# EAGLE design scoreboard_v1 (EAGLE 9.1.1)
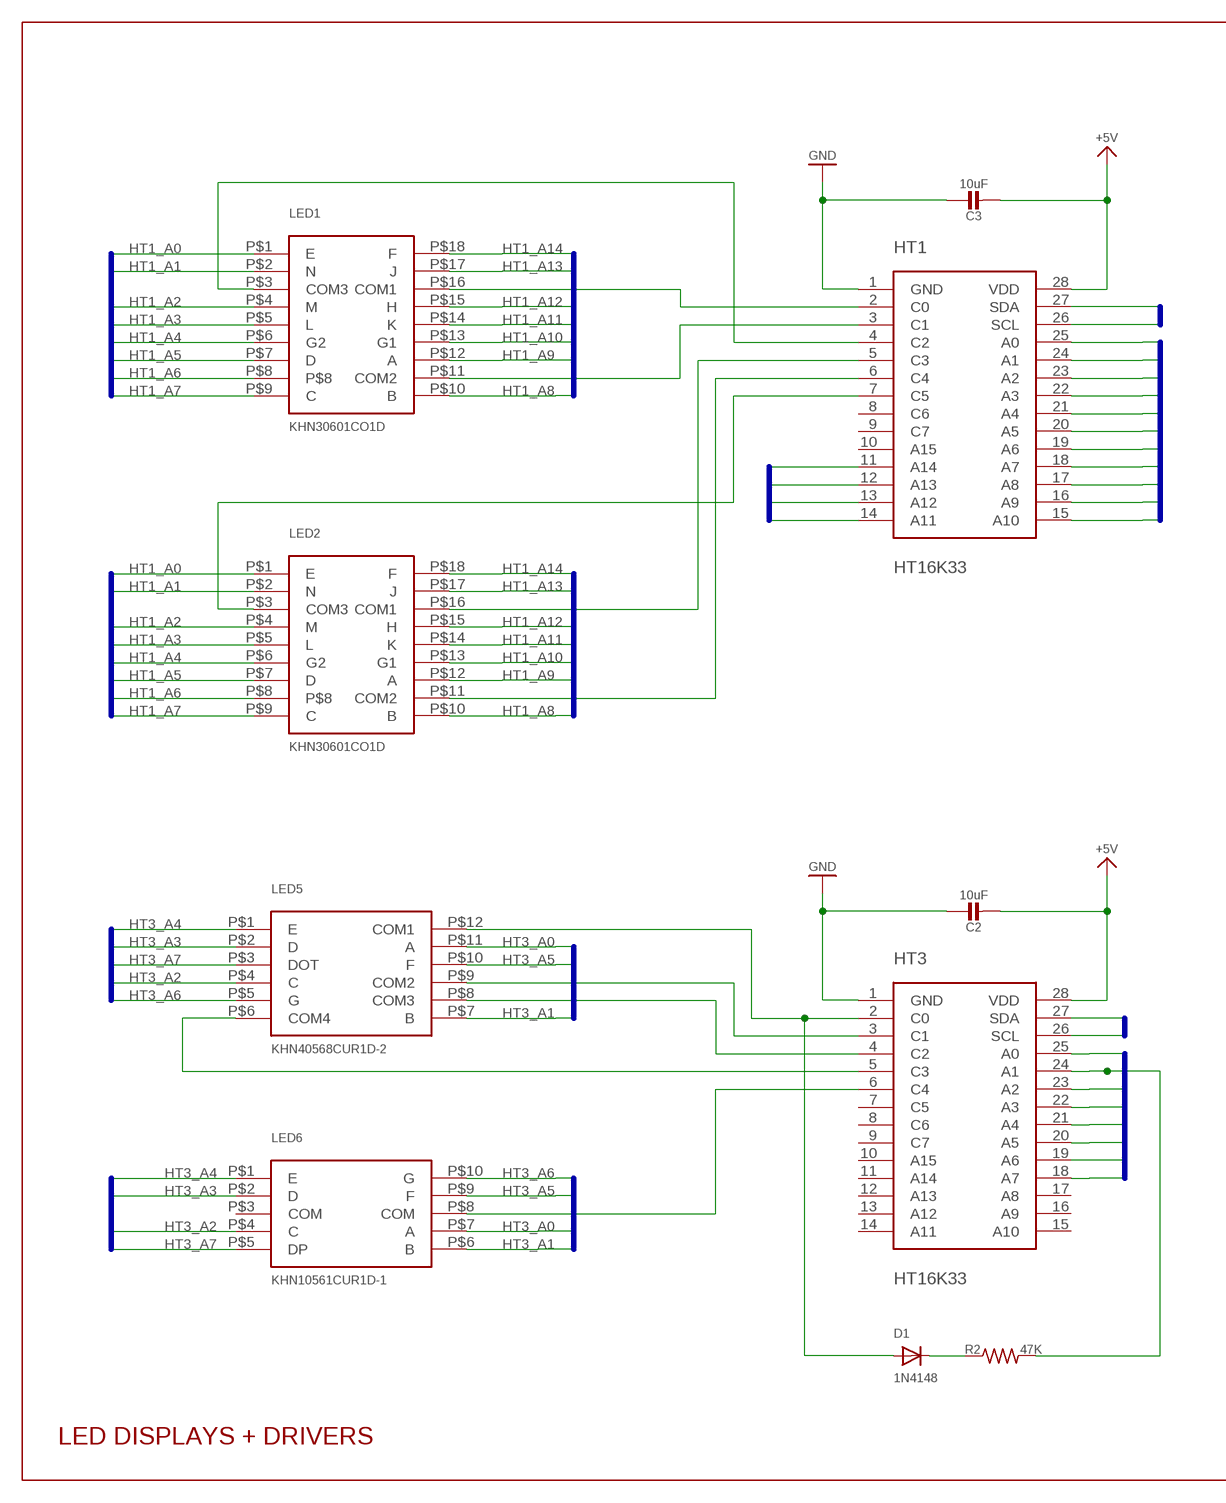
[diagram p0: schematic, sheet 1, part 1 of 2]
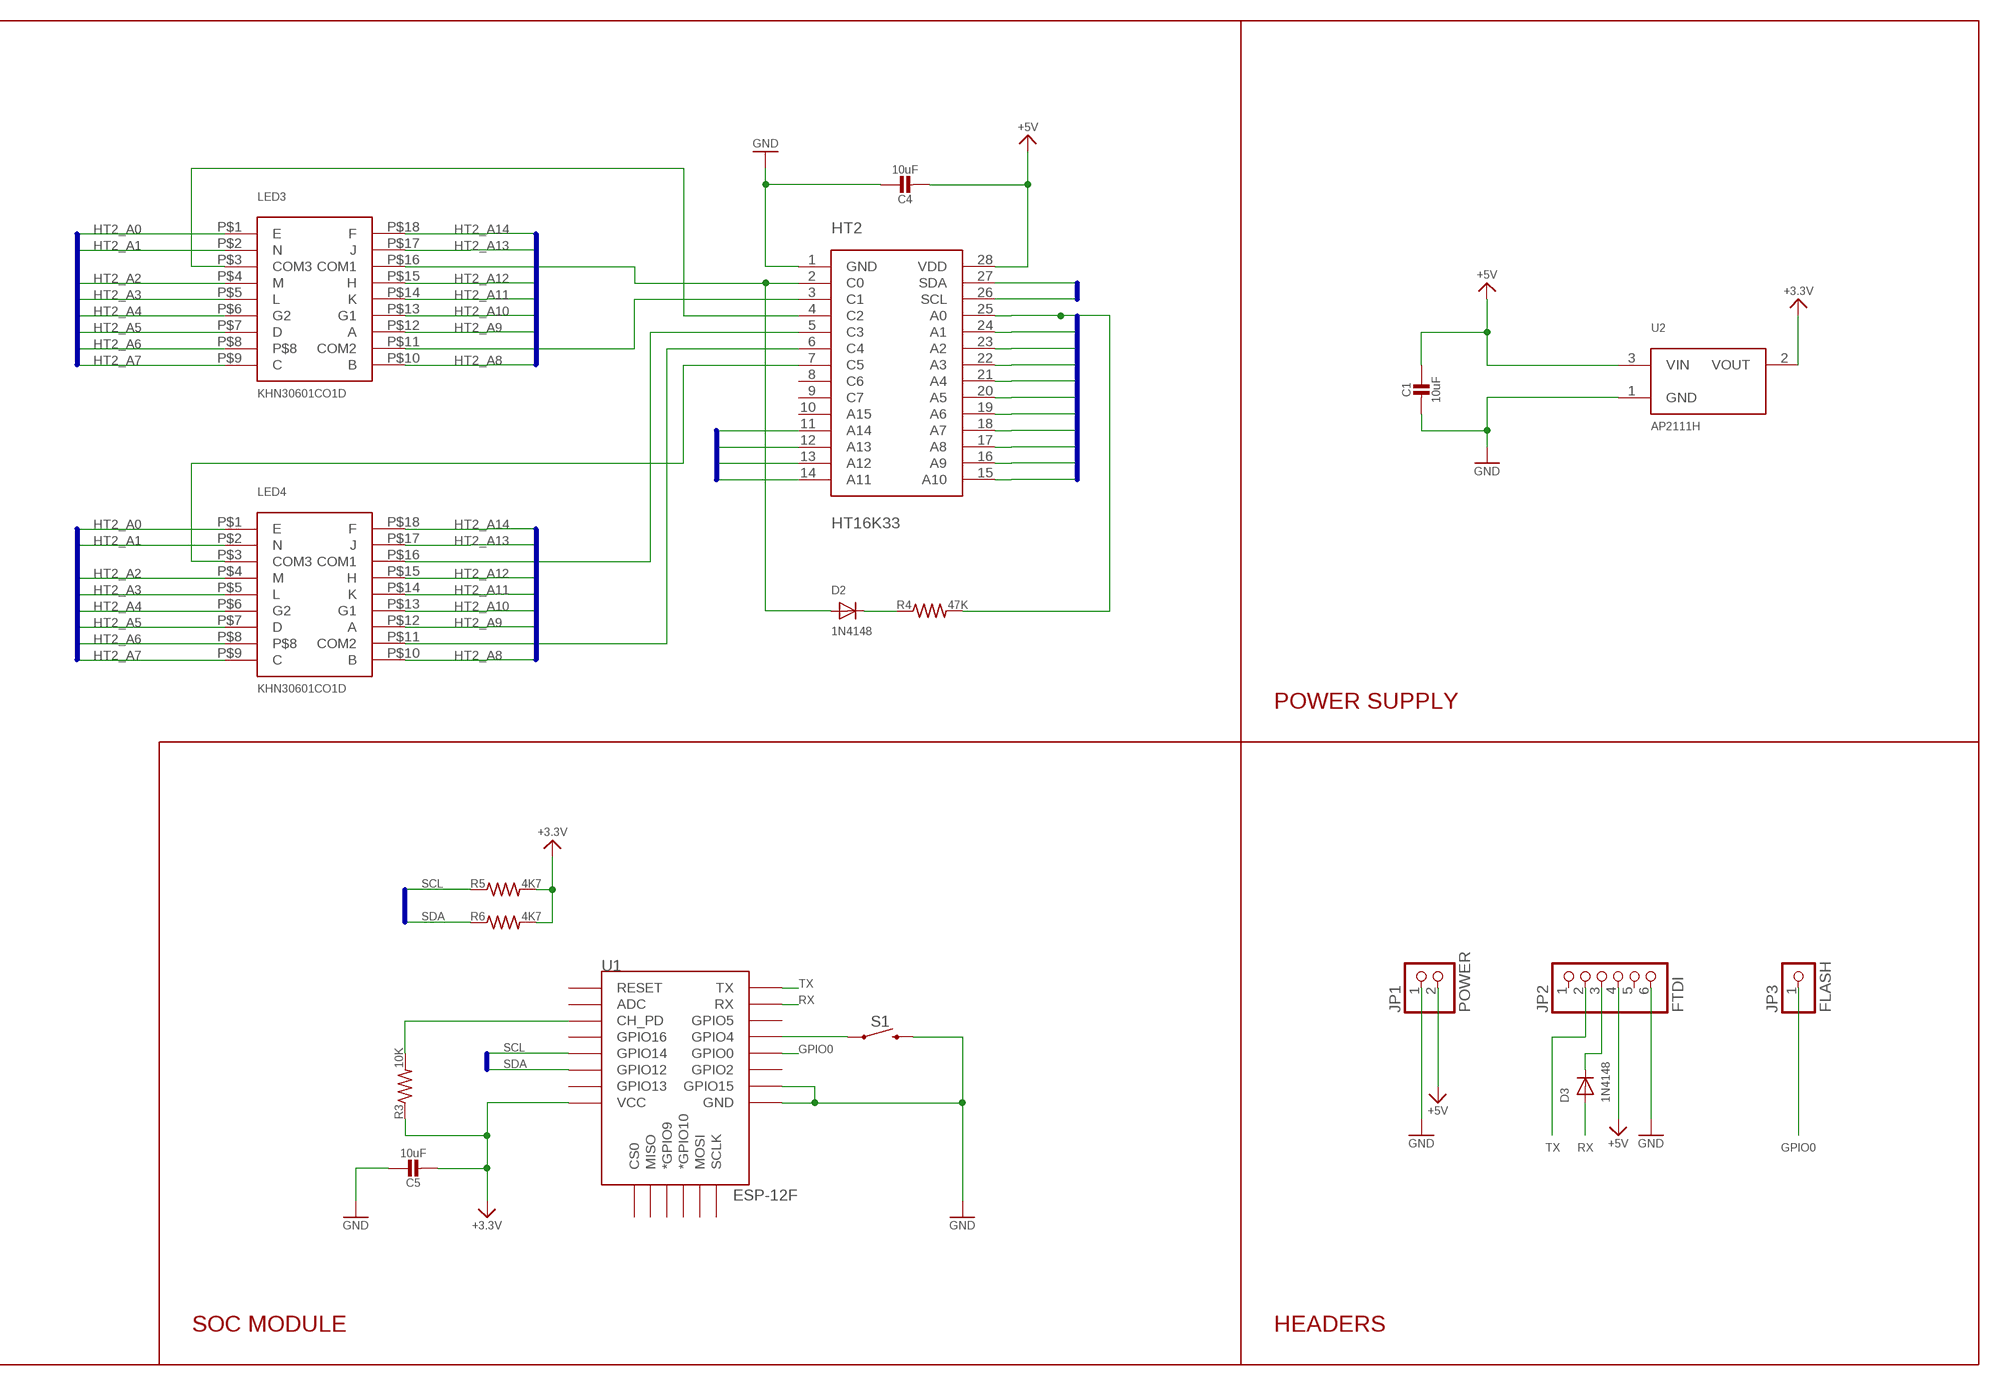
[diagram p1: schematic, sheet 1, part 2 of 2]

## Parts
C1  10uF  CAP_CERAMIC_1206  [_1206]
C2  10uF  CAP_CERAMIC_1206  [_1206]
C3  10uF  CAP_CERAMIC_1206  [_1206]
C4  10uF  CAP_CERAMIC_1206  [_1206]
C5  10uF  CAP_CERAMIC_1206  [_1206]
D1  1N4148  DIODESOD-123  [SOD-123]
D2  1N4148  DIODESOD-123  [SOD-123]
D3  1N4148  DIODESOD-123  [SOD-123]
HT1  HT16K33  [SOP28]
HT2  HT16K33  [SOP28]
HT3  HT16K33  [SOP28]
JP1  POWER  PINHD-1X2  [1X02]
JP2  FTDI  PINHD-1X6  [1X06]
JP3  FLASH  PINHD-1X1  [1X01]
LED1  KHN30601CO1D  [KHN30601CO1D]
LED2  KHN30601CO1D  [KHN30601CO1D]
LED3  KHN30601CO1D  [KHN30601CO1D]
LED4  KHN30601CO1D  [KHN30601CO1D]
LED5  KHN40568CUR1D-2  [KHN40568CUR1D-2]
LED6  KHN10561CUR1D-1  [KHN10561CUR1D-1]
R2  47K  R-US_R1206  [R1206]
R3  10K  R-US_R1206  [R1206]
R4  47K  R-US_R1206  [R1206]
R5  4K7  R-US_R1206  [R1206]
R6  4K7  R-US_R1206  [R1206]
S1  MOMENTARY-SWITCH-SPST-PTH-6.0MM  [TACTILE_SWITCH_PTH_6.0MM]
U1  ESP-12F  ESP12E  [ESP12E-SMD]
U2  AP2111H  [SOT223]

## Nets
3.3V [thick]: C5.2 R3.1 R5.2 R6.2 U1.VCC U2.2(VOUT) ; supply symbol labelled +3.3V
+5V [thick]: C1.1 C2.2 C3.2 C4.2 HT1.28(VDD) HT2.28(VDD) HT3.28(VDD) JP1.2 JP2.4 U2.3(VIN)
GND [thick]: C1.2 C2.1 C3.1 C4.1 C5.1 HT1.1(GND) HT2.1(GND) HT3.1(GND) JP1.1 JP2.6 S1.3 U1.GND U1.GPIO15 U2.1(GND)
GPIO0: JP3.1 U1.GPIO0
HT1_A0: HT1.25(A0) LED1.P$1(E) LED2.P$1(E)
HT1_A1: HT1.24(A1) LED1.P$2(N) LED2.P$2(N)
HT1_A2: HT1.23(A2) LED1.P$4(M) LED2.P$4(M)
HT1_A3: HT1.22(A3) LED1.P$5(L) LED2.P$5(L)
HT1_A4: HT1.21(A4) LED1.P$6(G2) LED2.P$6(G2)
HT1_A5: HT1.20(A5) LED1.P$7(D) LED2.P$7(D)
HT1_A6: HT1.19(A6) LED1.P$8 LED2.P$8
HT1_A7: HT1.18(A7) LED1.P$9(C) LED2.P$9(C)
HT1_A8: HT1.17(A8) LED1.P$10(B) LED2.P$10(B)
HT1_A9: HT1.16(A9) LED1.P$12(A) LED2.P$12(A)
HT1_A10: HT1.15(A10) LED1.P$13(G1) LED2.P$13(G1)
HT1_A11: HT1.14(A11) LED1.P$14(K) LED2.P$14(K)
HT1_A12: HT1.13(A12) LED1.P$15(H) LED2.P$15(H)
HT1_A13: HT1.12(A13) LED1.P$17(J) LED2.P$17(J)
HT1_A14: HT1.11(A14) LED1.P$18(F) LED2.P$18(F)
HT1_C0: HT1.2(C0) LED1.P$16(COM1)
HT1_C1: HT1.3(C1) LED1.P$11(COM2)
HT1_C2: HT1.4(C2) LED1.P$3(COM3)
HT1_C3: HT1.5(C3) LED2.P$16(COM1)
HT1_C4: HT1.6(C4) LED2.P$11(COM2)
HT1_C5: HT1.7(C5) LED2.P$3(COM3)
HT2_A0: HT2.25(A0) LED3.P$1(E) LED4.P$1(E) R4.2
HT2_A1: HT2.24(A1) LED3.P$2(N) LED4.P$2(N)
HT2_A2: HT2.23(A2) LED3.P$4(M) LED4.P$4(M)
HT2_A3: HT2.22(A3) LED3.P$5(L) LED4.P$5(L)
HT2_A4: HT2.21(A4) LED3.P$6(G2) LED4.P$6(G2)
HT2_A5: HT2.20(A5) LED3.P$7(D) LED4.P$7(D)
HT2_A6: HT2.19(A6) LED3.P$8 LED4.P$8
HT2_A7: HT2.18(A7) LED3.P$9(C) LED4.P$9(C)
HT2_A8: HT2.17(A8) LED3.P$10(B) LED4.P$10(B)
HT2_A9: HT2.16(A9) LED3.P$12(A) LED4.P$12(A)
HT2_A10: HT2.15(A10) LED3.P$13(G1) LED4.P$13(G1)
HT2_A11: HT2.14(A11) LED3.P$14(K) LED4.P$14(K)
HT2_A12: HT2.13(A12) LED3.P$15(H) LED4.P$15(H)
HT2_A13: HT2.12(A13) LED3.P$17(J) LED4.P$17(J)
HT2_A14: HT2.11(A14) LED3.P$18(F) LED4.P$18(F)
HT2_C0: D2.A HT2.2(C0) LED3.P$16(COM1)
HT2_C1: HT2.3(C1) LED3.P$11(COM2)
HT2_C2: HT2.4(C2) LED3.P$3(COM3)
HT2_C3: HT2.5(C3) LED4.P$16(COM1)
HT2_C4: HT2.6(C4) LED4.P$11(COM2)
HT2_C5: HT2.7(C5) LED4.P$3(COM3)
HT3_A0: HT3.25(A0) LED5.P$11(A) LED6.P$7(A)
HT3_A1: HT3.24(A1) LED5.P$7(B) LED6.P$6(B) R2.2
HT3_A2: HT3.23(A2) LED5.P$4(C) LED6.P$4(C)
HT3_A3: HT3.22(A3) LED5.P$2(D) LED6.P$2(D)
HT3_A4: HT3.21(A4) LED5.P$1(E) LED6.P$1(E)
HT3_A5: HT3.20(A5) LED5.P$10(F) LED6.P$9(F)
HT3_A6: HT3.19(A6) LED5.P$5(G) LED6.P$10(G)
HT3_A7: HT3.18(A7) LED5.P$3(DOT) LED6.P$5(DP)
HT3_C0: D1.A HT3.2(C0) LED5.P$12(COM1)
HT3_C1: HT3.3(C1) LED5.P$9(COM2)
HT3_C2: HT3.4(C2) LED5.P$8(COM3)
HT3_C3: HT3.5(C3) LED5.P$6(COM4)
HT3_C4: HT3.6(C4) LED6.P$8(COM)
N$1: S1.1 U1.GPIO4
N$2: D3.C JP2.3
N$5: D1.C R2.1
N$6: R3.2 U1.CH_PD
N$8: D2.C R4.1
RX: D3.A U1.RXD0(RX)
SCL: HT1.26(SCL) HT2.26(SCL) HT3.26(SCL) R5.1 U1.GPIO14
SDA: HT1.27(SDA) HT2.27(SDA) HT3.27(SDA) R6.1 U1.GPIO12
TX: JP2.2 U1.TXD0(TX)
Unconnected: HT1.8(C6) HT1.9(C7) HT1.10(A15) HT2.8(C6) HT2.9(C7) HT2.10(A15) HT3.7(C5) HT3.8(C6) HT3.9(C7) HT3.10(A15) HT3.11(A14) HT3.12(A13) HT3.13(A12) HT3.14(A11) HT3.15(A10) HT3.16(A9) HT3.17(A8) JP2.1 JP2.5 LED6.P$3(COM) U1.ADC U1.CS0 U1.GPIO2 U1.GPIO5 U1.GPIO9(*GPIO9) U1.GPIO10(*GPIO10) U1.GPIO13 U1.GPIO16 U1.MISO U1.MOSI U1.RESET U1.SCLK

## Buses
HT1A:HT1_A[0..7]
HT1B:HT1_A[8..14]
HT1_A[11..14]
HT1_A[0..10]
HT2B:HT2_A[8..14]
HT2_A[11..14]
HT2A:HT2_A[0..7]
HT2_A[0..10]
HT3:HT3_A[0..7]
I2C:SCL,SDA

## Notes on the sheet
- POWER SUPPLY
- LED DISPLAYS + DRIVERS | SOC MODULE | HEADERS

## Library data of the parts
C1-C5 = scoreboard_v1:CAP_CERAMIC: Ceramic Capacitors For new designs, use the packages preceded by an '_' character since they are more reliable: The following footprints should be used on most boards: _0402 - Standard footprint for regular board layouts _0603 - Standard footprint for regular board layouts _0805 - Standard footprint for regular board layouts _1206 - Standard footprint for regular board layouts For extremely tight-pitch boards where space is at a premium, the following 'micro-pitch' footprints can be used (smaller pads, no silkscreen outline, etc.): _0402MP - Micro-pitch footprint for very dense/compact boards _0603MP - Micro-pitch footprint for very dense/compact boards _0805MP - Micro-pitch footprint for very dense/compact boards _1206MP - Micro-pitch footprint for very dense/compact boards
D1-D3 = scoreboard_v1:DIODE: Diode SMADIODE - SMA Surface Mount Package 20V 1A Schottky Diode Digikey: 641-1014-6-ND DO-1N4148 - Through Hole Small Current Diode SOD-123 20V 1 A (.5mV Vf) Schottky Diode - Digikey: MBRX120TPMSCT-ND SOD-323 10V 570mA (.38mV Vf, 3ns) Schottky Diode - Digikey: ZLLS410CT-ND SOD-523 30V 30mA Schottky Diode (RB751S-40TE61) - Digikey: RB751S-40TE61CT-ND SOT23-R/W - SOT23 Package (R = Solder Paste/Reflow Ovens, W = Hand-Soldering) BAT54Film 40V 300mA - Digikey: 497-7162-1-ND
HT1-HT3 = scoreboard_v1:HT16K33: I2C LED Matrix Driver
JP1 = pinhead:PINHD-1X2: PIN HEADER
JP2 = pinhead:PINHD-1X6: PIN HEADER
JP3 = pinhead:PINHD-1X1: PIN HEADER
LED1-LED4 = ScoreBoard:KHN30601CO1D: 37.9*21.1*7.8mm, Amber color, 3-digit 14-segment LED Display
LED5 = ScoreBoard:KHN40568CUR1D-2: 4-digit 0.56inch, Red, Common cathode, LED Display
LED6 = ScoreBoard:KHN10561CUR1D-1: 1-digit 0.56inch, Red, Common cathode, LED Display
R2-R6 = scoreboard_v1:R-US_: RESISTOR, American symbol
S1 = scoreboard_v1:MOMENTARY-SWITCH-SPST: Momentary Switch (Pushbutton) - SPST Normally-open (NO) SPST momentary switches (buttons, pushbuttons). Variants PTH-12MM - 12mm square, through-hole Momentary Pushbutton Switch - 12mm Square <https://www.sparkfun.com/products/9190> (COM-09190) PTH-6.0MM, PTH-6.0MM-KIT - 6.0mm square, through-hole Mini Pushbutton Switch <https://www.sparkfun.com/products/97> (COM-00097) KIT package intended for soldering kit's - only one side of pads' copper is exposed. PTH-RIGHT-ANGLE-KIT - Right-angle, through-hole Right Angle Tactile Button <https://www.sparkfun.com/products/10791> - Used on SparkFun BigTime Watch Kit <https://www.sparkfun.com/products/11734> SMD-12MM - 12mm square, surface-mount Tactile Button - SMD (12mm) <https://www.sparkfun.com/products/12993> (COM-12993) Used on SparkFun PicoBoard <https://www.sparkfun.com/products/11888> SMD-4.5MM - 4.5mm Square Trackball Switch Used on SparkFun Blackberry Trackballer Breakout <https://www.sparkfun.com/products/13169> SMD-4.6MMX2.8MM - 4.60mm x 2.80mm, surface mount Used on SparkFun SAMD21 Mini Breakout <https://www.sparkfun.com/products/13664> SMD-5.2MM, SMD-5.2-REDUNDANT - 5.2mm square, surface-mount Mini Pushbutton Switch - SMD <https://www.sparkfun.com/products/8720> (COM-08720) Used on Arduino Pro Mini <https://www.sparkfun.com/products/11114> REDUNDANT package connects both switch circuits together SMD-6.0X3.5MM - 6.0 x 3.5mm, surface mount Momentary Reset Switch SMD <https://www.sparkfun.com/products/8229> (COM-08229) SMD-6.2MM-TALL - 6.2mm square, surface mount Tactile Button - SMD (6mm) <https://www.sparkfun.com/products/12992> Used on SparkFun Digital Sandbox <https://www.sparkfun.com/products/12651> SMD-RIGHT-ANGLE - Right-angle, surface mount Used on SparkFun Block for Intel® Edison - Arduino <https://www.sparkfun.com/products/13036>; PROD_ID: SWCH-08441; SF_SKU: COM-00097; SPICEPREFIX: B
U1 = scoreboard_v1:ESP12E: ESP12E Module
U2 = scoreboard_v1:AP2111H

## Net classes
1 thick: width 0.381 mm, drill 0.254 mm, clearance 0.254 mm to class 0, clearance 0.254 mm

## Board
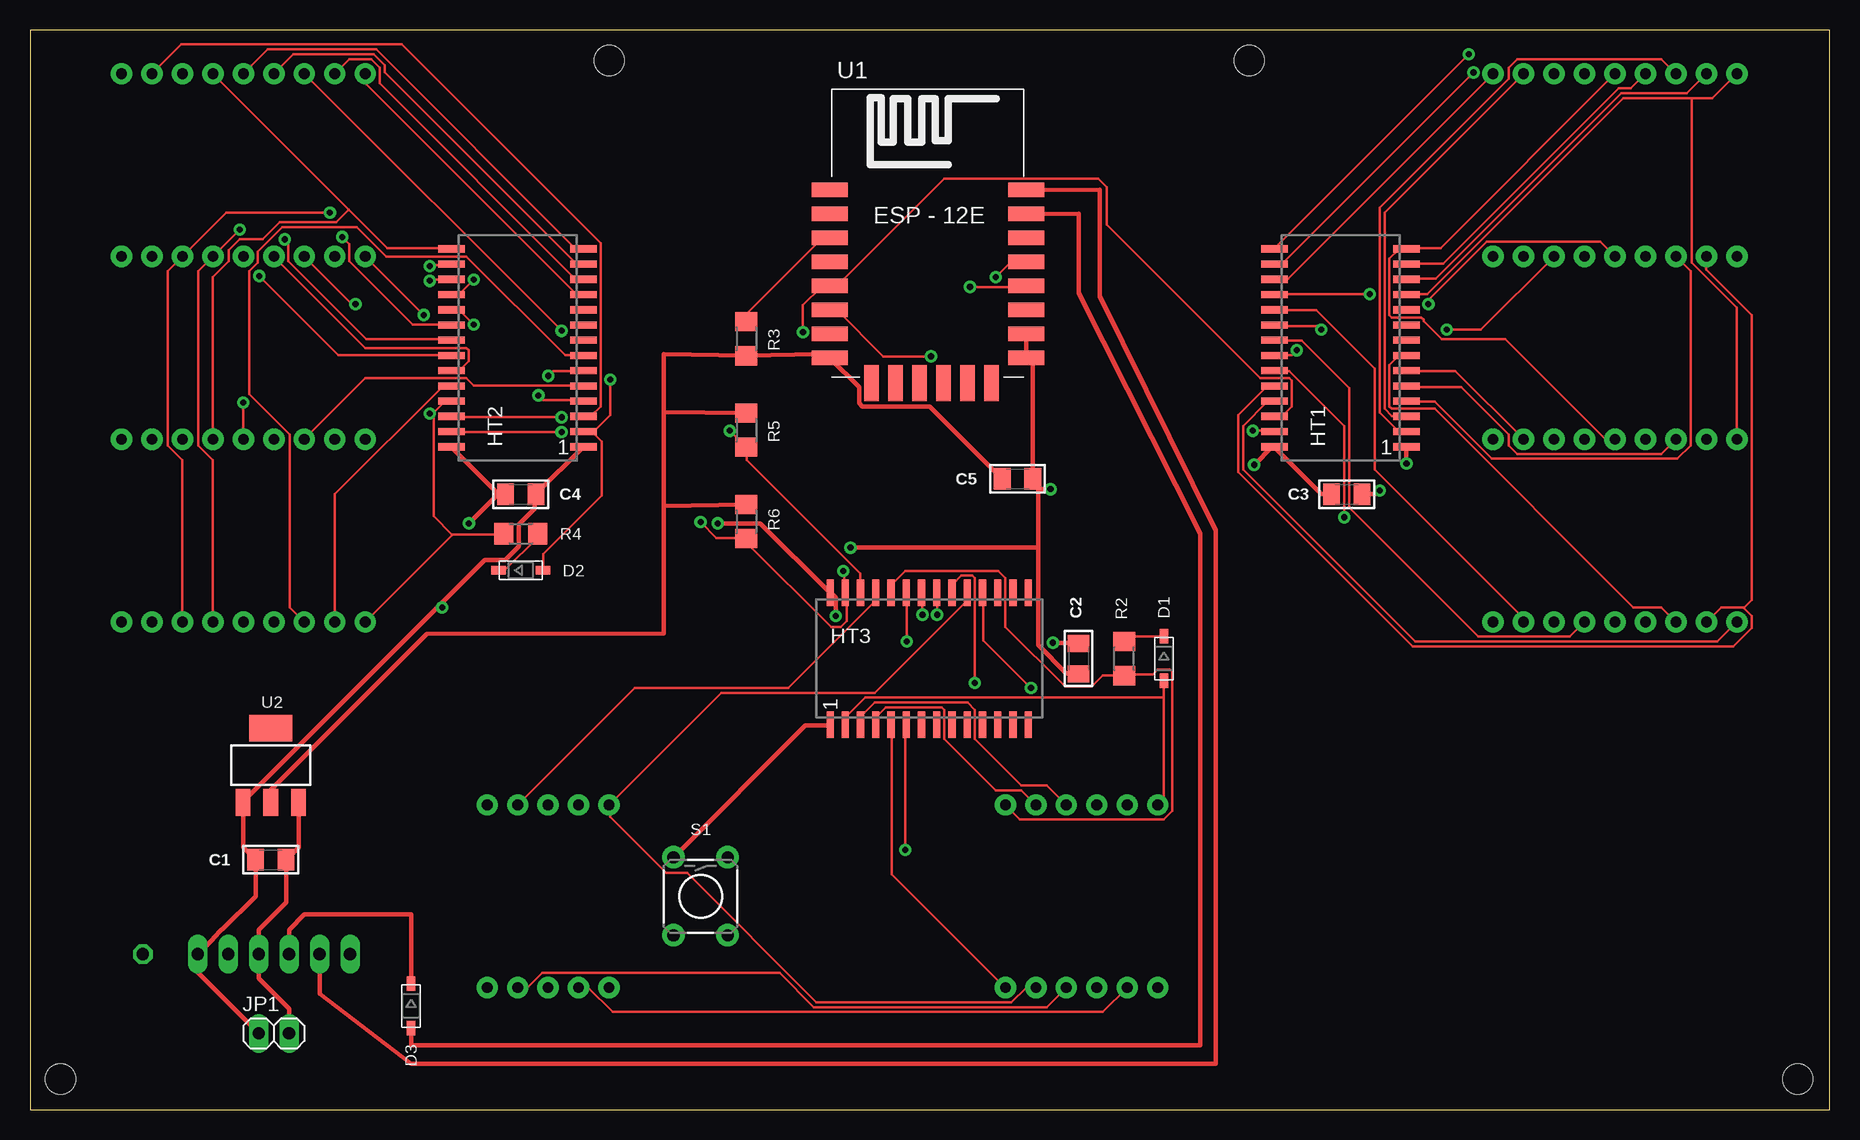
[diagram p2: board, top side]
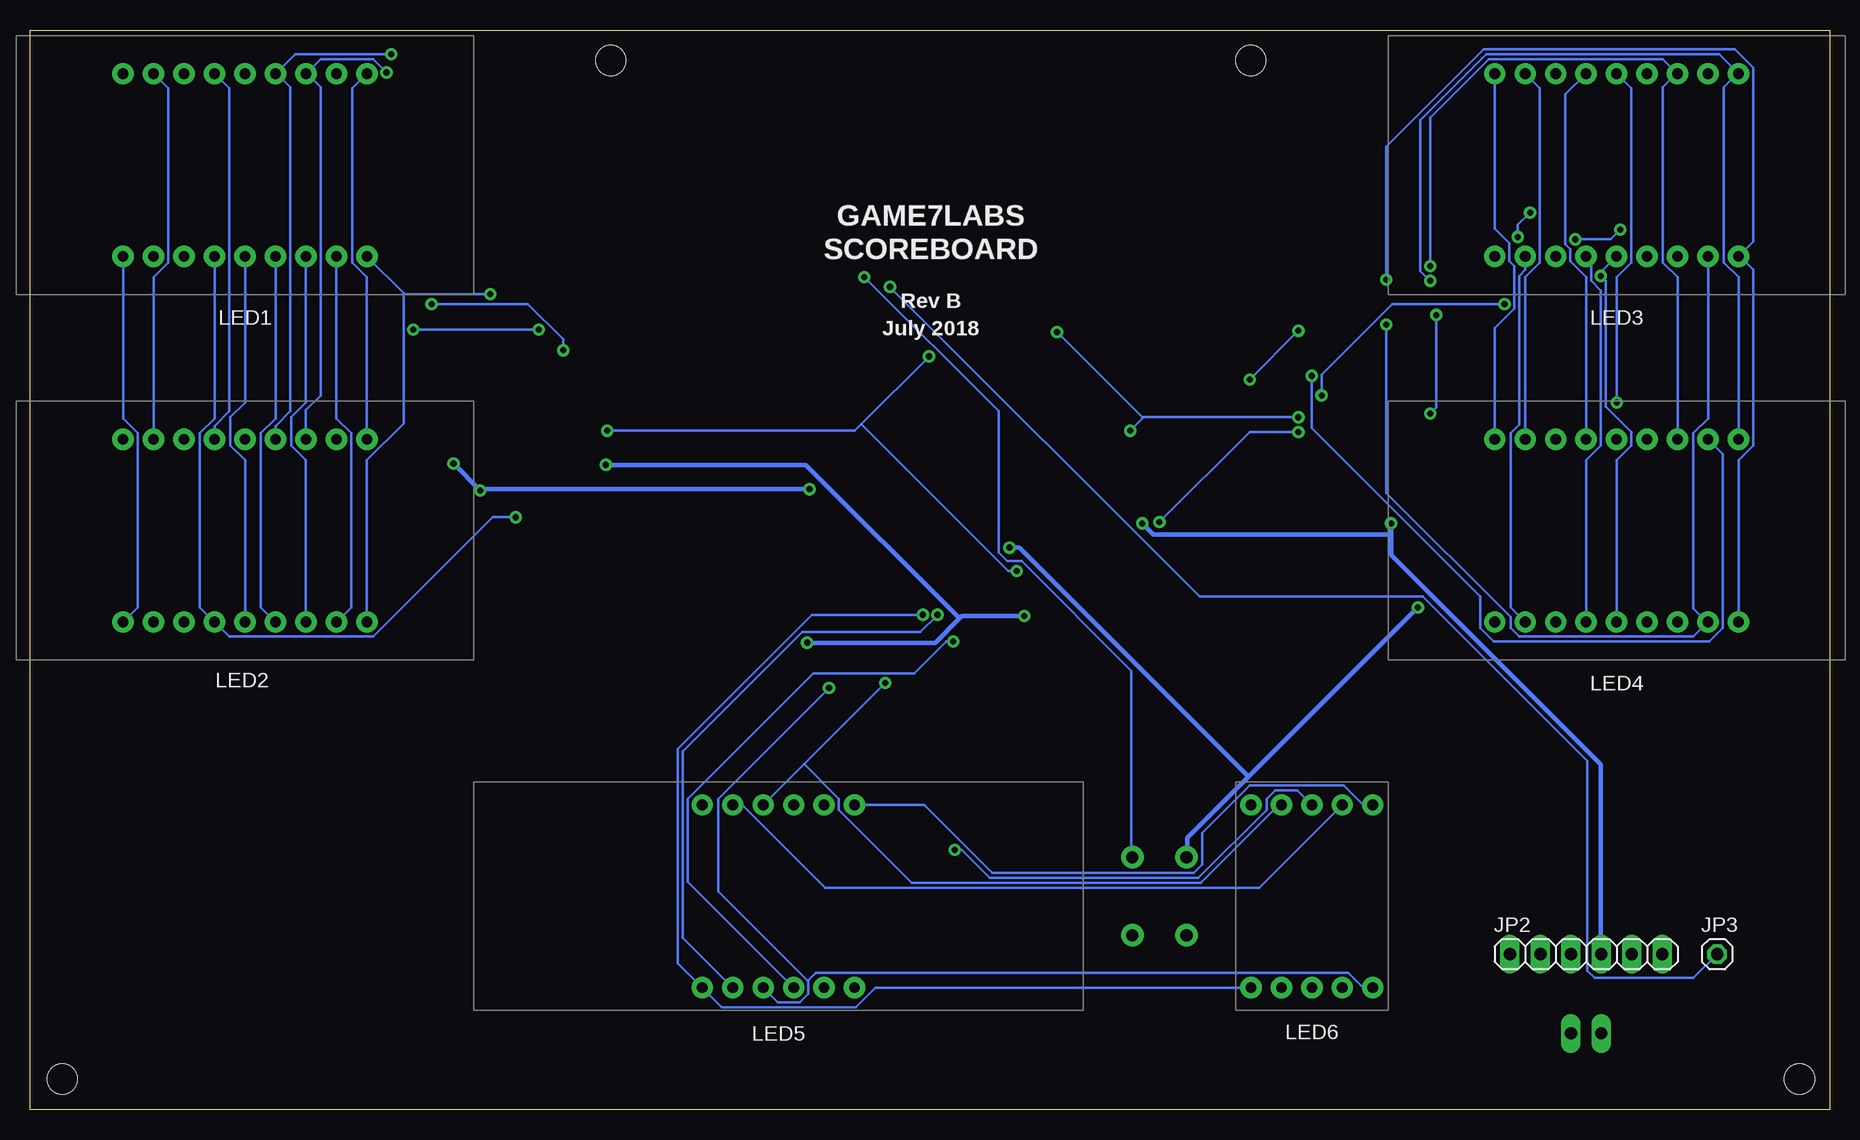
[diagram p3: board, bottom side, seen from below]

Size 150 x 90 mm. Coordinates in mm from the lower left corner, seen from the top.
Outline: 0,0 150,0 150,90 0,90 0,0
Copper layers (1*16): Top 0.035mm / dielectric 1.5mm / Bottom 0.035mm
Design rules "SparkFun": minimum track width 8mil, minimum drill 20mil, track to track 8mil, track to pad 8mil, pad to pad 8mil, via to via 8mil, smd to smd 8mil, copper to edge 10mil, drill to drill 8mil, minimum pad ring 12mil, minimum via ring 10mil, stop-mask expansion 4mil, vias tented up to drill 25mil, thermal gap 10mil
Holes 2.5 mm at 2.54,2.54 147.32,2.54 48.26,87.46 101.6,87.46

### Footprints (pad centres in the part's own frame; a part is rotated, then mirrored left to right if it is on the bottom)
_1206 = smd 1.4 x 1.8: 1 -1.27,0; 2 1.27,0
SOD-123 = smd 1.2 x 0.7: A 1.85,0; C -1.85,0
SOP28 = smd 0.6 x 2.2: 1 -8.255,-5.5; 2 -6.985,-5.5; 3 -5.715,-5.5; 4 -4.445,-5.5; 5 -3.175,-5.5; 6 -1.905,-5.5; 7 -0.635,-5.5; 8 0.635,-5.5; 9 1.905,-5.5; 10 3.175,-5.5; 11 4.445,-5.5; 12 5.715,-5.5; 13 6.985,-5.5; 14 8.255,-5.5; 15 8.255,5.5; 16 6.985,5.5; 17 5.715,5.5; 18 4.445,5.5; 19 3.175,5.5; 20 1.905,5.5; 21 0.635,5.5; 22 -0.635,5.5; 23 -1.905,5.5; 24 -3.175,5.5; 25 -4.445,5.5; 26 -5.715,5.5; 27 -6.985,5.5; 28 -8.255,5.5
1X02 = drill 1.016 long: 1 -1.27,0; 2 1.27,0
1X06 = drill 1.016 long: 1 -6.35,0; 2 -3.81,0; 3 -1.27,0; 4 1.27,0; 5 3.81,0; 6 6.35,0
1X01 = drill 1.016 octagon: 1 0,0
KHN30601CO1D = drill 0.889 pad 1.778: P$1 0,0; P$2 2.54,0; P$3 5.08,0; P$4 7.62,0; P$5 10.16,0; P$6 12.7,0; P$7 15.24,0; P$8 17.78,0; P$9 20.32,0; P$10 20.32,15.24; P$11 17.78,15.24; P$12 15.24,15.24; P$13 12.7,15.24; P$14 10.16,15.24; P$15 7.62,15.24; P$16 5.08,15.24; P$17 2.54,15.24; P$18 0,15.24
KHN40568CUR1D-2 = drill 0.889 pad 1.778: P$1 0,0; P$2 2.54,0; P$3 5.08,0; P$4 7.62,0; P$5 10.16,0; P$6 12.7,0; P$7 12.7,15.24; P$8 10.16,15.24; P$9 7.62,15.24; P$10 5.08,15.24; P$11 2.54,15.24; P$12 0,15.24
KHN10561CUR1D-1 = drill 0.889 pad 1.778: P$1 0,0; P$2 2.54,0; P$3 5.08,0; P$4 7.62,0; P$5 10.16,0; P$6 10.16,15.24; P$7 7.62,15.24; P$8 5.08,15.24; P$9 2.54,15.24; P$10 0,15.24
R1206 = smd 1.6 x 1.803: 1 -1.422,0; 2 1.422,0
TACTILE_SWITCH_PTH_6.0MM = drill 1.016 pad 1.88: 1 -3.251,2.261; 2 3.251,2.261; 3 -3.251,-2.261; 4 3.251,-2.261
ESP12E-SMD = smd 3 x 1.2: ADC -8.3,3.8; CH_PD -8.3,1.8; GND 8.1,-8.2; GPIO0 8.1,-2.2; GPIO2 8.1,-4.2; GPIO4 8.1,-0.2; GPIO5 8.1,1.8; GPIO12 -8.3,-4.2; GPIO13 -8.3,-6.2; GPIO14 -8.3,-2.2; GPIO15 8.1,-6.2; GPIO16 -8.3,-0.2; RESET -8.3,5.8; RXD0 8.1,3.8; TXD0 8.1,5.8; VCC -8.3,-8.2 | smd 1.2 x 3: CS0 -4.8,-10.3; GPIO9 -0.8,-10.3; GPIO10 1.2,-10.3; MISO -2.8,-10.3; MOSI 3.2,-10.3; SCLK 5.2,-10.3
SOT223 = smd 1.219 x 2.235: 1 -2.311,-3.099; 2 0,-3.099; 3 2.311,-3.099 | smd 3.6 x 2.2: 4 0,3.099

### Placement (x,y rotation side)
C1  20.07,20.83 180 top
C2  87.38,37.59 90 top
C3  109.73,51.31 180 top
C4  40.89,51.31 180 top
C5  82.3,52.58 180 top
D1  94.49,37.59 270 top
D2  40.89,44.96 0 top
D3  31.75,8.64 270 top
HT1  109.22,63.5 90 top
HT2  40.64,63.5 90 top
HT3  74.93,37.59 0 top
JP1  20.32,6.35 0 top
JP2  20.32,12.95 0 bottom
JP3  9.4,12.95 0 bottom
LED1  142.24,71.12 0 bottom
LED2  142.24,40.64 0 bottom
LED3  27.94,71.12 0 bottom
LED4  27.94,40.64 0 bottom
LED5  93.98,10.16 0 bottom
LED6  48.26,10.16 0 bottom
R2  91.19,37.59 270 top
R3  59.69,64.26 90 top
R4  40.89,48.01 180 top
R5  59.69,56.64 90 top
R6  59.69,49.02 90 top
S1  55.88,17.78 270 top
U1  74.93,70.87 0 top
U2  20.07,28.7 0 top

### Tracks (layer width: path | path; a pad name or v marks a point on that pad's centre or on a via)
3.3V
  Top 0.381: 52.83,50.29 52.83,39.7 33.07,39.65 20.07,26.65 U2.2 | 52.83,50.29 R6.2 | 52.83,50.29 52.83,58.17 | 52.83,58.17 R5.2 | 52.83,58.17 52.83,62.99 R3.1 65.79,62.99 U1.VCC 69.08,60.21 69.08,58.88 69.35,58.62 74.98,58.62 C5.2
+5V  (via drill 0.51)
  Top 0.381: JP1.2 21.59,8.38 19.05,10.92 JP2.4 19.05,14.99 21.34,17.27 C1.1 22.38,21.87 U2.3 | C3.2 108.41,51.31 107.59,51.31 103.73,55.17 HT1.28 103.53,55.27 v102.01,53.75 | v85.24,38.91 87.38,38.91 C2.2 | v67.16,41.15 67.16,42.67 66.75,43.08 HT3.28 66.55,43.18 60.86,48.87 v57.3,48.87 | 39.01,51.31 C4.2 | 39.01,51.31 35.15,55.17 HT2.28 | v36.58,48.87 38.91,51.21 39.01,51.31
  Bottom 0.381: v85.24,38.91 74.57,38.91 72.54,40.95 | 72.54,40.95 72.34,41.15 v67.16,41.15 | v102.01,53.75 85.34,53.75 72.64,41.05 72.54,40.95 | 36.58,47.95 36.58,46.23 19.1,28.75 19.1,13.01 JP2.4 | 36.58,47.95 v36.58,48.87 | v57.3,48.87 56.39,47.95 36.68,47.95 36.58,47.95
GND  (via drill 0.51)
  Top 0.381: JP1.1 13.97,11.43 JP2.6 15.25,14.24 15.25,14.29 15.99,15.02 16.04,15.02 18.8,17.78 C1.2 17.75,21.87 U2.1 17.78,25.7 34.14,42.06 | C5.1 83.57,62.48 U1.GND 83.01,62.79 83.01,64.62 U1.GPIO15 | v112.47,51.61 112.17,51.31 111.05,51.31 C3.1 | v114.71,53.85 114.71,55.17 HT1.1 | 84.02,46.84 84.02,52.02 83.62,52.43 C5.1 | 84.02,46.84 84.02,38.71 86.36,36.37 87.38,36.37 C2.1 | v85.04,51.71 84.12,51.71 C5.1 | HT3.1 66.65,32 64.62,32 53.65,21.03 S1.3 | HT2.1 46.13,55.27 C4.1 42.06,51.21 42.06,50.09 40.74,48.77 40.74,46.94 39.62,45.82 37.9,45.82 34.14,42.06 | v34.34,41.86 34.24,41.96 34.14,42.06 | v68.38,46.84 83.92,46.84 84.02,46.84
  Bottom 0.381: v114.71,53.85 v112.47,51.61 112.37,51.71 v85.04,51.71 | v34.34,41.86 48.46,27.74 | 48.46,27.74 53.54,22.66 53.54,21.03 S1.3 | v68.38,46.84 67.56,46.84 48.56,27.84 48.46,27.74
GPIO0  (via drill 0.51)
  Top 0.203: v78.33,68.58 83.01,68.58 U1.GPIO0
  Bottom 0.203: v78.33,68.58 52.53,42.77 33.93,42.77 20.22,29.06 20.22,11.58 19.61,10.97 11.38,10.97 9.45,12.9 JP3.1
HT1_A0
  Top 0.203: LED2.P$1 140.61,39.01 115.42,39.01 101.09,53.34 101.09,57 103.12,59.03 103.63,59.03 HT1.25
  Bottom 0.203: LED1.P$1 142.24,57.61 141.02,56.39 141.02,41.86 LED2.P$1
HT1_A1
  Top 0.203: 142.8,41.81 142.75,41.86 140.92,41.86 LED2.P$2 | 142.8,41.81 143.46,41.15 143.46,40.13 141.94,38.61 115.21,38.61 100.69,53.14 100.69,57.91 103.02,60.25 103.63,60.25 HT1.24 | LED1.P$2 139.7,70 143.46,66.24 143.46,42.47 142.85,41.86 142.8,41.81
HT1_A2  (via drill 0.51)
  Top 0.203: v109.53,49.38 109.53,57 104.95,61.57 103.73,61.57 HT1.23
  Bottom 0.203: v109.53,49.38 111.45,49.38 121.41,39.42 133.4,39.42 LED2.P$4 135.84,41.86 135.84,56.39 134.62,57.61 LED1.P$4
HT1_A3  (via drill 0.51)
  Top 0.203: v105.56,63.3 105.16,62.89 103.73,62.89 HT1.22 | v116.53,67.16 116.53,67.46 121.41,72.34 130.86,72.34 LED1.P$5
  Bottom 0.203: v105.56,63.3 105.56,64.21 108.51,67.16 v116.53,67.16 | LED2.P$5 132.08,54.15 133.3,55.37 133.3,57.71 132.08,58.93 LED1.P$5
HT1_A4
  Top 0.203: LED2.P$6 128.32,39.42 120.7,39.42 109.93,50.19 109.93,60.15 105.97,64.11 103.73,64.11 HT1.21
  Bottom 0.203: LED1.P$6 129.54,57.61 130.76,56.39 130.76,41.86 LED2.P$6
HT1_A5  (via drill 0.51)
  Top 0.203: v107.59,65.02 107.29,65.33 103.73,65.33 HT1.20 | v118.06,65.02 120.9,65.02 LED1.P$7
  Bottom 0.203: v118.06,65.02 v107.59,65.02 | LED2.P$7 127,54.15 128.22,55.37 128.22,57.71 127,58.93 LED1.P$7
HT1_A6
  Top 0.203: LED2.P$8 124.46,40.95 112.06,53.34 112.06,61.77 107.19,66.65 103.73,66.65 HT1.19
  Bottom 0.203: LED1.P$8 124.46,57.61 123.24,56.39 123.24,41.86 LED2.P$8
HT1_A7  (via drill 0.51)
  Top 0.203: v111.66,67.97 103.73,67.97 HT1.18
  Bottom 0.203: v111.66,67.97 118.77,67.97 118.82,68.02 | LED1.P$9 118.82,68.02 | LED2.P$9 121.92,54.15 118.87,57.2 118.87,67.97 118.82,68.02
HT1_A8
  Top 0.203: LED1.P$10 104.85,69.29 103.73,69.29 HT1.17
  Bottom 0.203: LED2.P$10 121.92,69.39 123.14,70.61 123.14,85.14 LED1.P$10
HT1_A9  (via drill 0.51)
  Top 0.203: v120.29,86.46 104.34,70.51 103.73,70.51 HT1.16
  Bottom 0.203: v120.29,86.46 121.41,87.58 125.78,87.58 LED1.P$12 126.9,86.36 125.78,85.24 125.78,59.54 127,58.32 LED2.P$12
HT1_A10  (via drill 0.51)
  Top 0.203: v119.89,87.99 103.73,71.83 HT1.15
  Bottom 0.203: v119.89,87.99 127.91,87.99 LED1.P$13 129.44,86.36 128.32,85.24 128.32,58.22 129.54,57 LED2.P$13
HT1_A11
  Top 0.203: LED1.P$14 117.55,71.83 114.81,71.83 HT1.14 114.71,71.73 114.1,71.73 113.28,70.92 113.28,66.24 113.49,66.04 115.93,66.04 116.13,65.84 116.13,65.73 117.65,64.21 122.94,64.21 131.27,55.88 LED2.P$14
HT1_A12
  Top 0.203: LED1.P$15 133.4,85.14 132.38,85.14 117.75,70.51 114.81,70.51 HT1.13
  Bottom 0.203: LED2.P$15 134.62,57 133.4,58.22 133.4,85.14 LED1.P$15
HT1_A13
  Top 0.203: LED1.P$17 138.07,84.73 132.59,84.73 117.14,69.29 114.81,69.29 HT1.12
  Bottom 0.203: LED2.P$17 139.7,69.39 138.48,70.61 138.48,85.14 LED1.P$17
HT1_A14
  Top 0.203: 138.48,84.33 140.21,84.33 LED1.P$18 | 138.48,84.33 132.79,84.33 116.43,67.97 114.81,67.97 HT1.11 | LED2.P$18 142.24,66.85 138.48,70.61 138.48,84.33
HT1_C0
  Top 0.203: LED1.P$16 135.94,87.58 123.95,87.58 123.24,86.87 123.24,85.95 112.47,75.18 112.47,58.12 114,56.59 114.71,56.59 HT1.2
HT1_C1
  Top 0.203: LED1.P$11 112.88,74.78 112.88,58.42 113.49,57.81 114.71,57.81 HT1.3
HT1_C2
  Top 0.203: LED1.P$3 138.38,69.9 138.38,55.37 137.26,54.25 121.82,54.25 117.04,59.03 114.81,59.03 HT1.4
HT1_C3
  Top 0.203: LED2.P$16 135.94,54.66 123.95,54.66 123.24,55.37 123.24,56.29 119.28,60.25 114.81,60.25 HT1.5
HT1_C4
  Top 0.203: LED2.P$11 118.77,61.57 114.81,61.57 HT1.6
HT1_C5
  Top 0.203: LED2.P$3 135.94,41.86 133.6,41.86 117.04,58.42 113.49,58.42 113.28,58.62 113.28,62.08 114,62.79 114.71,62.79 HT1.7
HT2_A0  (via drill 0.51)
  Top 0.203: LED4.P$1 35.2,47.9 | 35.2,47.9 35.26,47.95 39.42,47.95 R4.2 | 33.63,58.01 33.63,49.48 35.15,47.95 35.2,47.9 | 33.63,58.01 33.63,58.12 34.54,59.03 35.05,59.03 HT2.25 | v32.82,66.24 LED3.P$1 | 33.63,58.01 v33.33,58.01
  Bottom 0.203: v32.82,66.24 32.82,58.52 v33.33,58.01
HT2_A1
  Top 0.203: LED4.P$2 25.4,51.31 34.34,60.25 35.05,60.25 HT2.24
  Bottom 0.203: LED3.P$2 25.4,70 25.91,69.49 25.91,57.1 26.62,56.39 26.62,41.86 LED4.P$2
HT2_A2
  Top 0.203: LED3.P$4 27.94,63.5 36.37,63.5 36.58,63.3 36.58,62.38 35.87,61.67 35.15,61.67 HT2.23
  Bottom 0.203: LED4.P$4 20.32,54.15 19.1,55.37 19.1,68.28 19.91,69.09 19.91,70.71 LED3.P$4
HT2_A3  (via drill 0.51)
  Top 0.203: v19.1,69.49 25.7,62.89 35.05,62.89 HT2.22
  Bottom 0.203: LED3.P$5 19.1,69.8 v19.1,69.49 18.69,69.09 18.69,58.62 16.56,56.49 16.56,55.37 17.78,54.15 LED4.P$5
HT2_A4  (via drill 0.51)
  Top 0.203: v21.23,72.54 21.54,72.24 21.54,70.71 28.04,64.21 35.05,64.21 HT2.21 | v17.48,73.36 LED3.P$6 14.02,69.9 14.02,55.37 15.24,54.15 LED4.P$6
  Bottom 0.203: v21.23,72.54 18.29,72.54 v17.48,73.36
HT2_A5  (via drill 0.51)
  Top 0.203: v26.01,72.75 26.62,72.14 26.62,70.71 31.9,65.43 35.05,65.43 HT2.20 | v24.99,74.78 16.36,74.78 LED3.P$7 11.48,69.9 11.48,55.37 12.7,54.15 LED4.P$7
  Bottom 0.203: v26.01,72.75 26.01,73.76 v24.99,74.78
HT2_A6  (via drill 0.51)
  Top 0.203: v36.98,65.43 35.76,66.65 35.15,66.65 HT2.19
  Bottom 0.203: v36.98,65.43 36.98,51.41 26.62,41.05 26.62,40.13 25.91,39.42 11.38,39.42 LED4.P$8 10.26,40.64 11.38,41.76 11.38,56.39 10.16,57.61 LED3.P$8
HT2_A7  (via drill 0.51)
  Top 0.203: v36.98,69.19 35.76,67.97 35.15,67.97 HT2.18
  Bottom 0.203: v36.98,69.19 36.98,80.26 28.85,88.39 7.92,88.39 6.4,86.87 6.4,72.34 LED3.P$9 7.52,71.12 6.4,70 6.4,55.37 7.62,54.15 LED4.P$9
HT2_A8  (via drill 0.51)
  Top 0.203: v33.33,69.09 33.43,69.19 35.05,69.19 HT2.17
  Bottom 0.203: v33.33,69.09 34.14,69.9 34.14,82.5 28.65,87.99 9.25,87.99 LED3.P$10 7.72,86.36 8.84,85.24 8.84,70.61 7.62,69.39 LED4.P$10
HT2_A9  (via drill 0.51)
  Top 0.203: v33.33,70.31 33.43,70.41 35.05,70.41 HT2.16
  Bottom 0.203: v33.33,70.31 33.33,82.7 28.45,87.58 13.92,87.58 LED3.P$12 12.8,86.36 13.92,85.24 13.92,70.61 12.7,69.39 LED4.P$12
HT2_A10
  Top 0.203: LED3.P$13 26.57,75.03 | 26.57,75.03 29.77,71.83 35.05,71.83 HT2.15 | LED4.P$13 15.24,69.39 16.56,70.71 16.56,71.63 17.48,72.54 19.41,72.54 20.83,73.97 25.5,73.97 26.52,74.98 26.57,75.03
HT2_A11  (via drill 0.51)
  Top 0.203: LED3.P$14 19.81,88.39 28.85,88.39 45.41,71.83 46.13,71.83 HT2.14 | v17.78,58.93 LED4.P$14
  Bottom 0.203: v17.78,58.93 17.78,69.39 16.56,70.61 16.56,85.14 LED3.P$14
HT2_A12
  Top 0.203: LED3.P$15 21.95,87.99 28.65,87.99 29.57,87.07 29.57,86.46 45.52,70.51 46.13,70.51 HT2.13
  Bottom 0.203: LED4.P$15 20.32,69.39 21.64,70.71 21.64,71.73 22.05,72.14 22.05,84.63 LED3.P$15
HT2_A13
  Top 0.203: LED3.P$17 26.62,87.58 28.45,87.58 29.16,86.87 29.16,85.55 45.41,69.29 46.13,69.29 HT2.12
  Bottom 0.203: LED4.P$17 25.4,69.39 24.18,70.61 24.18,85.14 LED3.P$17
HT2_A14
  Top 0.203: LED3.P$18 27.94,85.55 45.52,67.97 46.13,67.97 HT2.11
  Bottom 0.203: LED4.P$18 27.94,65.13 26.31,66.75 26.31,70.31 26.72,70.71 26.72,72.24 27.94,73.46 LED3.P$18
HT2_C0  (via drill 0.51)
  Top 0.203: D2.A 42.77,45.01 42.77,46.33 47.65,51.21 47.65,55.68 46.84,56.49 46.23,56.49 HT2.2 46.94,56.49 48.36,57.91 v48.36,60.86 | v44.3,64.92 LED3.P$16
  Bottom 0.203: v48.36,60.86 v44.3,64.92
HT2_C1
  Top 0.203: LED3.P$11 12.6,88.8 30.99,88.8 47.55,72.24 47.55,58.62 46.74,57.81 46.23,57.81 HT2.3
HT2_C2  (via drill 0.51)
  Top 0.203: v42.37,59.54 42.77,59.13 46.13,59.13 HT2.4 | v27.13,67.16 26.82,67.16 LED3.P$3
  Bottom 0.203: v42.37,59.54 42.37,61.27 36.47,67.16 v27.13,67.16
HT2_C3
  Top 0.203: LED4.P$16 27.94,60.96 36.37,60.96 36.98,60.35 46.13,60.35 HT2.5
HT2_C4  (via drill 0.51)
  Top 0.203: v43.18,61.16 43.59,61.57 46.13,61.57 HT2.6
  Bottom 0.203: v43.18,61.16 43.18,56.79 29.16,42.77 29.16,40.13 28.04,39.01 10.06,39.01 8.94,40.13 8.94,54.66 LED4.P$11
HT2_C5
  Top 0.203: LED4.P$3 21.64,41.86 21.64,56.29 18.29,59.64 18.29,69.9 19,70.61 19,71.53 21.03,73.56 27.23,73.56 29.67,71.12 36.37,71.12 44.6,62.89 46.13,62.89 HT2.7
HT3_A0
  Top 0.203: LED6.P$7 50.39,35.15 63.2,35.15 70.41,42.37 70.41,43.08 HT3.25
  Bottom 0.203: LED5.P$11 90.63,25.4 83.72,18.49 47.55,18.49 LED6.P$7
HT3_A1
  Top 0.203: HT3.24 71.83,43.18 71.83,43.79 72.95,44.91 80.67,44.91 81.28,44.3 81.28,40.23 86.26,35.26 88.49,35.26 89.41,36.17 91.14,36.17 R2.2 91.24,36.27 93.57,36.27 93.98,36.68 95,36.68 95.2,36.47 95.2,24.89 94.49,24.18 82.5,24.18 LED5.P$7
  Bottom 0.203: LED6.P$6 38.91,25.4 40.54,27.03 48.36,27.03 52.32,23.06 52.32,20.42 53.03,19.71 69.8,19.71 75.49,25.4 LED5.P$7
HT3_A2  (via drill 0.51)
  Top 0.203: v73.05,39.01 73.05,43.08 HT3.23 | LED6.P$4 41.45,10.16 42.67,11.38 62.48,11.38 65.33,8.53 84.73,8.53 LED5.P$4
  Bottom 0.203: v73.05,39.01 73.66,39.01 76.3,36.37 84.73,36.37 95.2,25.91 95.2,19 LED5.P$4
HT3_A3  (via drill 0.51)
  Top 0.203: v74.37,41.25 74.37,43.08 HT3.22 | LED6.P$2 46.53,10.16 48.56,8.13 89.41,8.13 LED5.P$2
  Bottom 0.203: v74.37,41.25 75.79,39.83 85.65,39.83 95.61,29.87 95.61,14.33 LED5.P$2
HT3_A4  (via drill 0.51)
  Top 0.203: v75.59,41.25 75.59,43.08 HT3.21
  Bottom 0.203: v75.59,41.25 84.84,41.25 96.01,30.07 96.01,12.19 LED5.P$1 92.35,8.53 81.18,8.53 79.55,10.16 LED6.P$1
HT3_A5  (via drill 0.51)
  Top 0.203: v78.74,35.56 78.74,44.3 78.54,44.5 77.62,44.5 76.91,43.79 76.91,43.18 HT3.20
  Bottom 0.203: LED5.P$10 85.5,28.8 | 85.5,28.8 v78.74,35.56 | LED6.P$9 45.92,25.4 52.43,18.9 76.5,18.9 82.6,24.99 82.6,25.91 85.45,28.75 85.5,28.8
HT3_A6
  Top 0.203: HT3.19 78.03,43.08 78.03,42.37 70.41,34.75 57.61,34.75 LED6.P$10 48.36,25.4 48.36,24.38 53.03,19.71 54.76,19.71 65.53,8.94 81.79,8.94 83.01,10.16 LED5.P$5
HT3_A7  (via drill 0.51)
  Top 0.203: v83.41,35.15 79.45,39.12 79.45,43.08 HT3.18
  Bottom 0.203: v83.41,35.15 92.66,25.91 92.66,18.19 85.19,10.72 | 85.19,10.72 85.14,10.67 85.14,9.65 85.85,8.94 87.68,8.94 LED5.P$3 | LED6.P$5 38.91,10.16 40.13,11.38 84.53,11.38 85.14,10.77 85.19,10.72
HT3_C0
  Top 0.203: 94.49,34.34 94.49,25.91 LED5.P$12 | 94.49,34.34 94.49,35.66 D1.A | 94.49,34.34 69.6,34.34 67.97,32.72 67.97,32.11 HT3.2
HT3_C1
  Top 0.203: LED5.P$9 84.73,27.03 82.6,27.03 78.74,30.89 78.74,33.33 78.13,33.93 70.41,33.93 69.29,32.82 69.29,32.11 HT3.3
HT3_C2
  Top 0.203: LED5.P$8 82.6,26.62 80.47,26.62 76.2,30.89 76.2,33.33 76,33.53 71.32,33.53 70.51,32.72 70.51,32.11 HT3.4
HT3_C3
  Top 0.203: LED5.P$6 71.83,19.61 71.83,32 HT3.5
HT3_C4  (via drill 0.51)
  Top 0.203: v72.95,21.64 72.95,32 HT3.6
  Bottom 0.203: v72.95,21.64 72.34,21.64 70,19.3 52.63,19.3 46.94,24.99 46.94,25.91 46.23,26.62 44.4,26.62 LED6.P$8
N$1  (via drill 0.51)
  Top 0.203: v80.47,69.39 81.69,70.61 83.01,70.61 U1.GPIO4
  Bottom 0.203: v80.47,69.39 69.29,58.22 69.29,46.43 68.58,45.72 67.36,45.72 58.22,36.58 58.22,21.03 S1.1
N$2
  Top 0.381: JP2.3 21.59,14.99 22.86,16.26 31.75,16.26 D3.C
N$5
  Top 0.203: D1.C 94.49,39.42 91.64,39.42 91.24,39.01 R2.1
N$6
  Top 0.203: R3.2 59.74,65.73 59.74,66.34 66.04,72.64 66.55,72.64 U1.CH_PD
N$8
  Top 0.203: D2.C 39.12,45.01 39.62,45.01 42.27,47.65 42.27,47.95 R4.1
RX
  Top 0.381: D3.A 31.75,5.33 97.54,5.33 97.54,48.01 87.38,68.07 87.38,74.68 U1.RXD0
SCL  (via drill 0.51)
  Top 0.203: HT3.26 69.19,43.18 69.19,44.7 59.74,54.15 59.74,55.17 R5.1 59.64,55.27 v58.32,56.59 | v44.3,57.71 35.15,57.71 HT2.26 | HT1.26 103.73,57.81 104.34,57.81 105.16,58.62 105.16,60.76 104.95,60.96 102.51,60.96 89.71,73.76 89.71,76.91 89,77.62 76.2,77.62 67.26,68.68 66.65,68.68 U1.GPIO14 66.55,68.58 65.94,68.58 64.41,67.06 v64.41,64.82
  Bottom 0.203: v44.3,57.71 57.2,57.71 57.25,57.66 | v58.32,56.59 57.25,57.66 | v64.41,64.82 57.3,57.71 57.25,57.66
SDA  (via drill 0.51)
  Top 0.203: v44.3,56.49 35.15,56.49 HT2.27 | v55.88,48.97 57.2,47.65 59.64,47.65 R6.1 59.74,47.55 59.74,47.24 66.75,40.23 67.56,40.23 68.07,40.74 68.07,42.98 67.97,43.08 HT3.27 67.87,43.18 67.87,44.81 v67.77,44.91 | v101.91,56.59 103.63,56.59 HT1.27 | v75.08,62.79 71.12,62.79 67.26,66.65 66.65,66.65 U1.GPIO12
  Bottom 0.203: v44.3,56.49 48.36,56.49 v55.88,48.97 | v101.91,56.59 81.28,56.59 80.72,57.15 | v75.08,62.79 80.72,57.15 | v67.77,44.91 68.48,44.91 80.67,57.1 80.72,57.15
TX
  Top 0.381: JP2.2 24.13,9.65 31.75,3.81 98.81,3.81 98.81,48.26 89.15,67.82 89.15,76.71 U1.TXD0

### Text on the board
bPlace: GAME7LABS | SCOREBOARD | Rev B | July 2018